# EAGLE schematic MultiWiiChassis_messed (EAGLE 6.2)
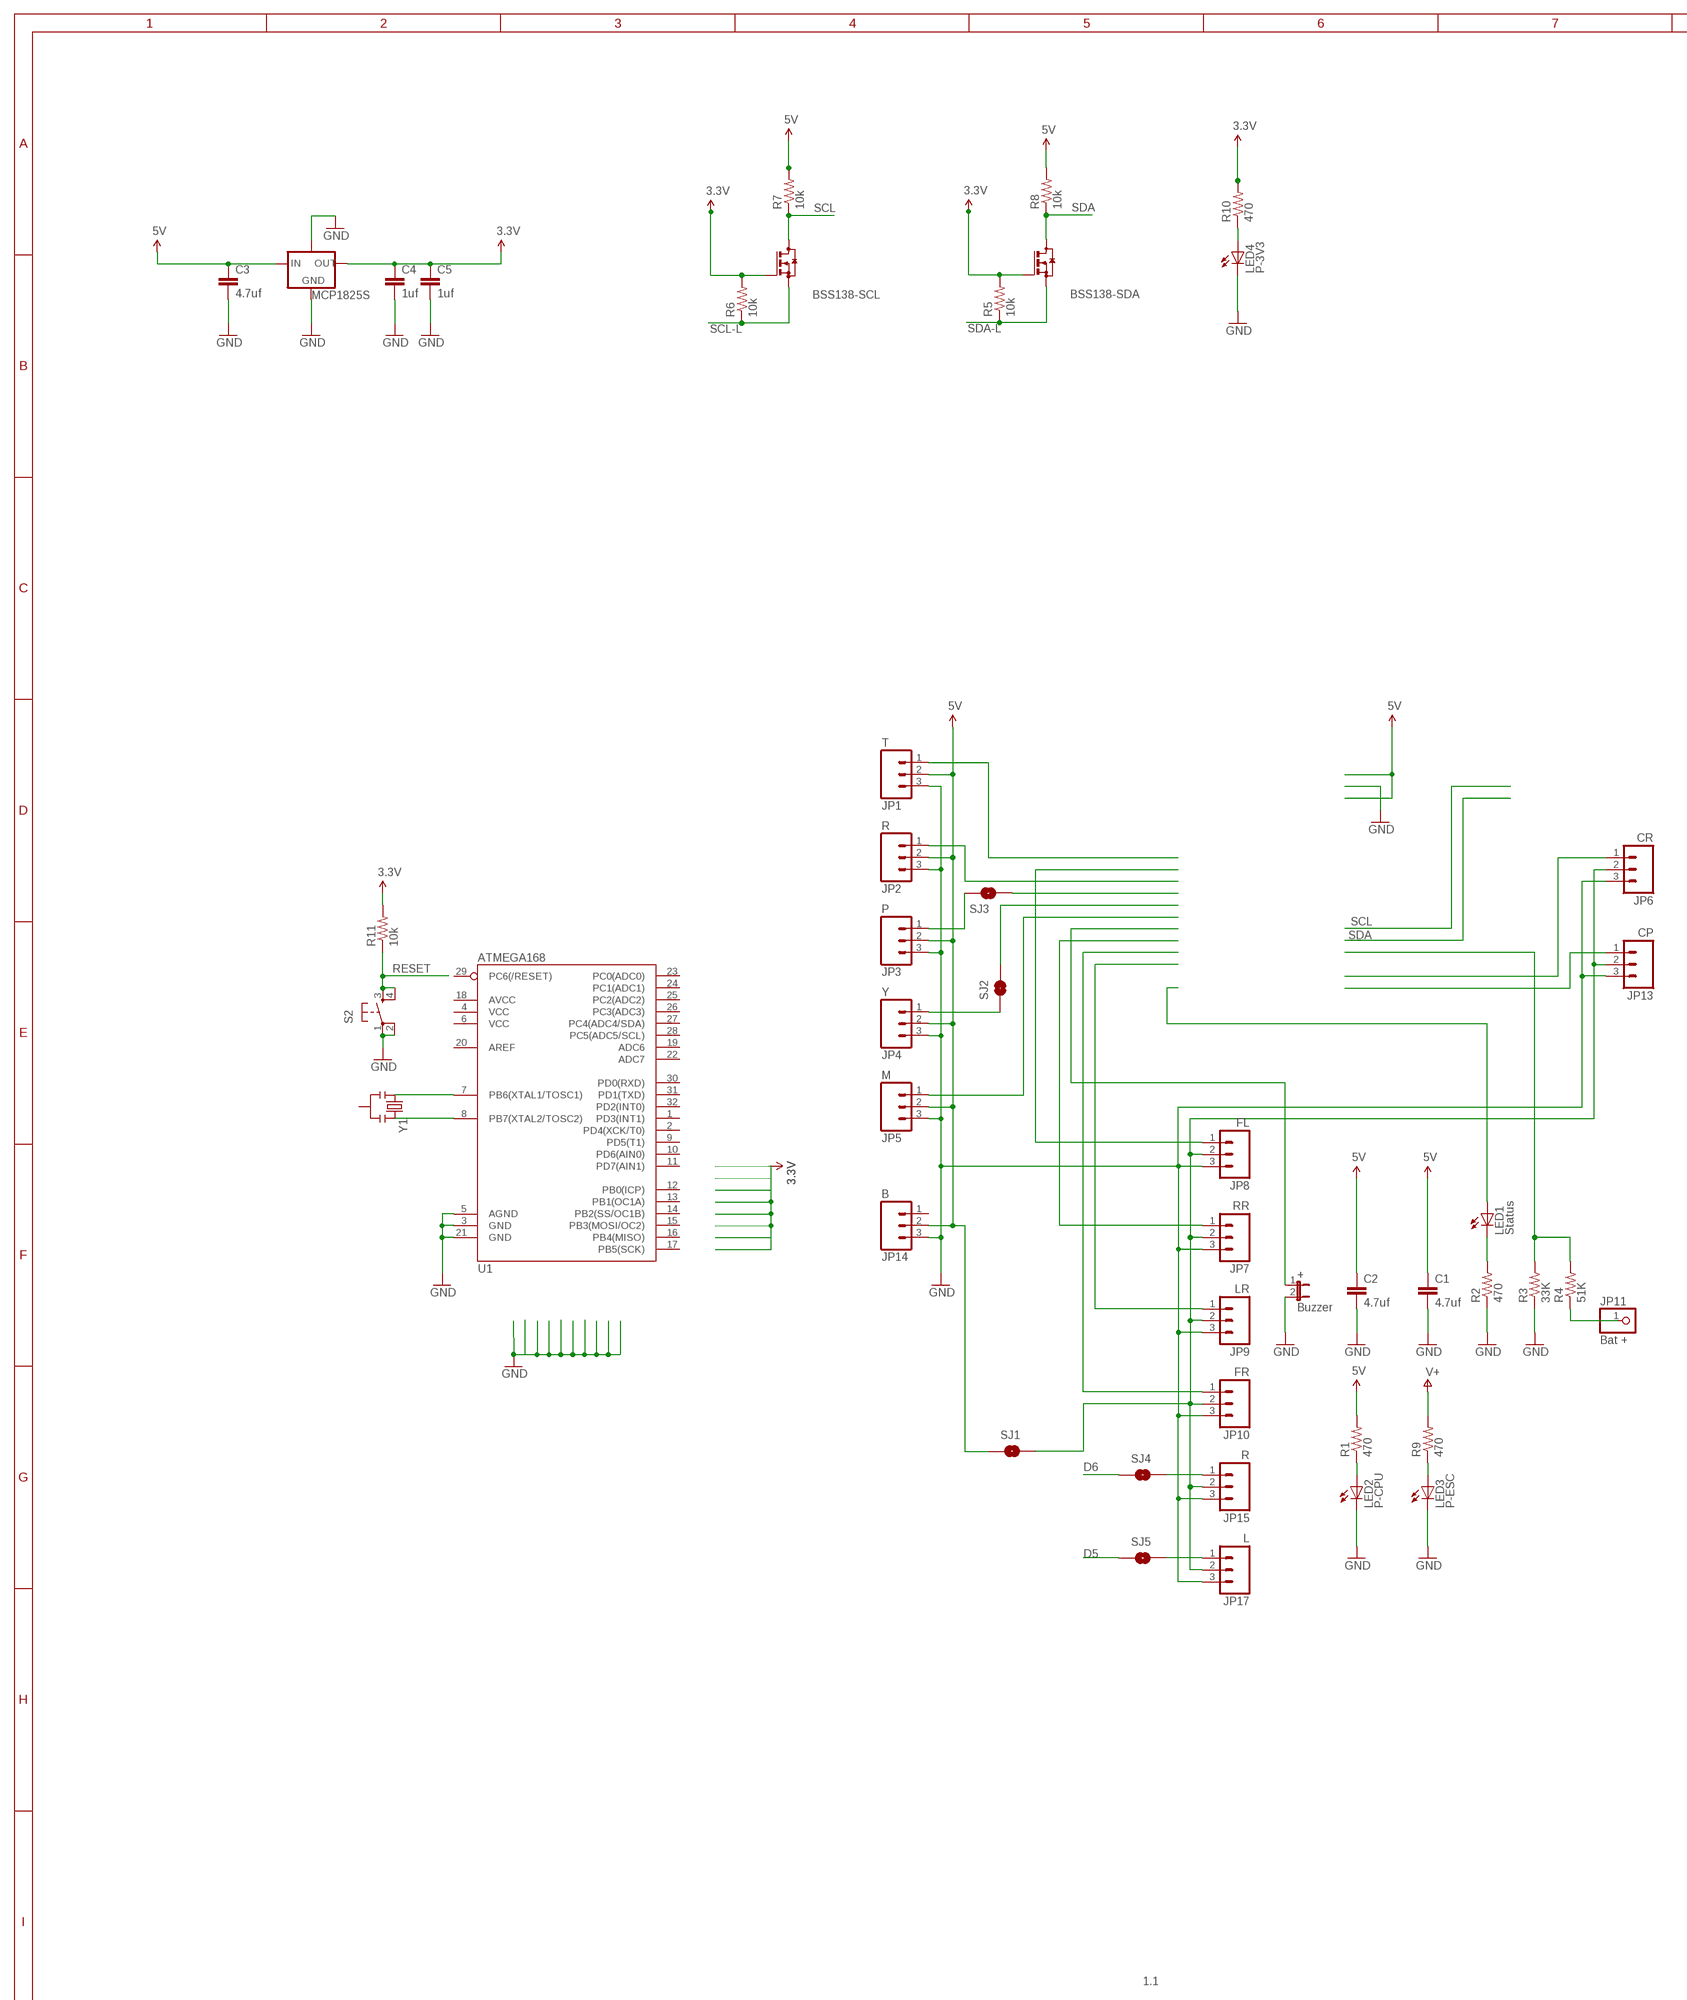
[diagram p0: schematic, sheet 1, part 1 of 2]
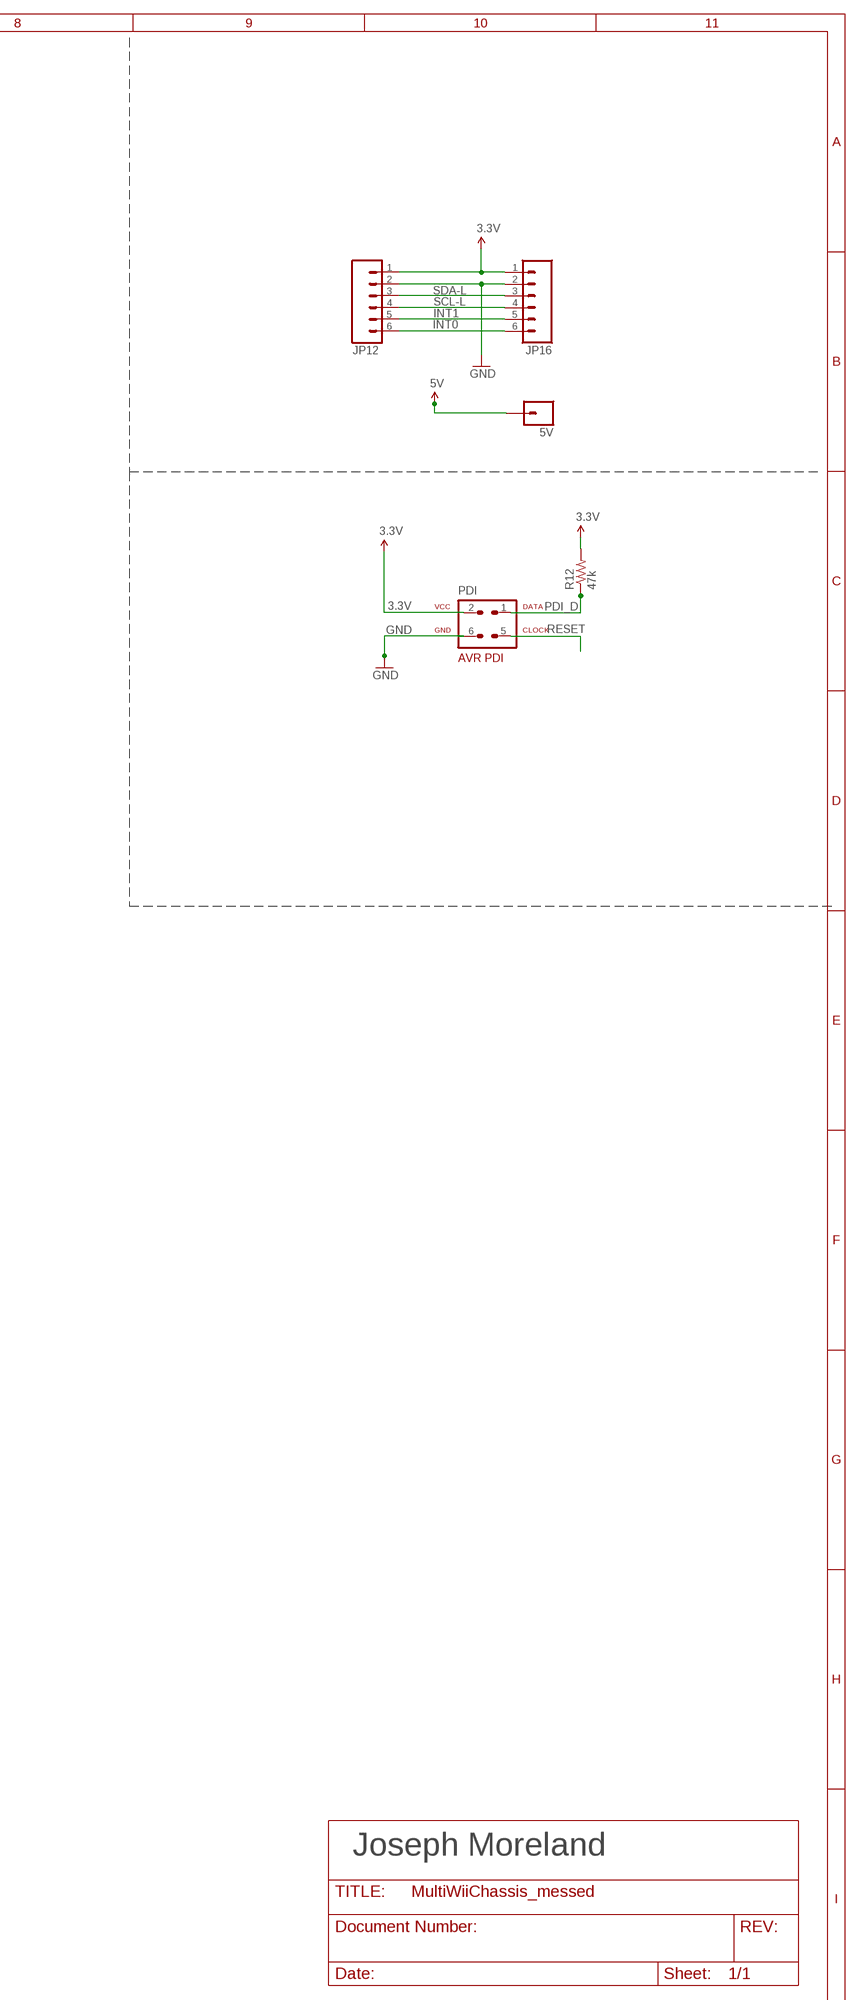
[diagram p1: schematic, sheet 1, part 2 of 2]

## Parts
5V  M01PTH  [1X01]
+  Buzzer  JUMPER-2PTH  [1X02]
BSS138-SCL  BSS138BOTTOM  [SOT23_BOT]
BSS138-SDA  BSS138BOTTOM  [SOT23_BOT]
C1  4.7uf  CAP0805  [0805]
C2  4.7uf  CAP0805  [0805]
C3  4.7uf  CAP0805  [0805]
C4  1uf  CAP0805  [0805]
C5  1uf  CAP0805  [0805]
JP1  T  M03PTH  [1X03]
JP2  R  M03PTH  [1X03]
JP3  P  M03PTH  [1X03]
JP4  Y  M03PTH  [1X03]
JP5  M  M03PTH  [1X03]
JP6  CR  M03PTH  [1X03]
JP7  RR  M03PTH  [1X03]
JP8  FL  M03PTH  [1X03]
JP9  LR  M03PTH  [1X03]
JP10  FR  M03PTH  [1X03]
JP11  Bat +  PINHD-1X1  [1X01]
JP12  M06LOCK  [1X06_LOCK]
JP13  CP  M03PTH  [1X03]
JP14  B  M03PTH  [1X03]
JP15  R  M03PTH  [1X03]
JP16  M06LOCK  [1X06_LOCK]
JP17  L  M03PTH  [1X03]
LED1  Status  LED1206  [LED-1206]
LED2  P-CPU  LED1206  [LED-1206]
LED3  P-ESC  LED1206  [LED-1206]
LED4  P-3V3  LED1206  [LED-1206]
MCP1825S  V_REG_MCP1825S  V_REG_MCP1825SBOTTOM  [SOT223_BOT]
PDI  AVR-PDIVERT  [AVR-ISP-6]
R1  470  RESISTOR0805-RES  [0805]
R2  470  RESISTOR0805-RES  [0805]
R3  33K  RESISTOR0805-RES  [0805]
R4  51K  RESISTOR0805-RES  [0805]
R5  10k  RESISTOR0805-RES  [0805]
R6  10k  RESISTOR0805-RES  [0805]
R7  10k  RESISTOR0805-RES  [0805]
R8  10k  RESISTOR0805-RES  [0805]
R9  470  RESISTOR0805-RES  [0805]
R10  470  RESISTOR0805-RES  [0805]
R11  10k  RESISTOR0603-RES  [0603-RES]
R12  47k  RESISTOR0603-RES  [0603-RES]
S2  TAC_SWITCHSMD  [TACTILE_SWITCH_SMD]
SJ1  SOLDERJUMPERNO  [SJ_2S-NO]
SJ2  SOLDERJUMPERNO  [SJ_2S-NO]
SJ3  SOLDERJUMPERNO  [SJ_2S-NO]
SJ4  SOLDERJUMPERNO  [SJ_2S-NO]
SJ5  SOLDERJUMPERNO  [SJ_2S-NO]
U1  ATMEGA168  [TQFP32-08]
Y1  RESONATORSMD  [RESONATOR-SMD]

## Nets
3.3V: BSS138-SCL.G BSS138-SDA.G C4.1 C5.1 JP12.1 JP16.1 MCP1825S.3(OUT) PDI.2 R5.2 R6.2 R10.2 R11.2 R12.2
5V: 5V.1 C1.1 C2.1 C3.1 JP1.2 JP2.2 JP3.2 JP4.2 JP5.2 JP14.2 MCP1825S.1(IN) R1.2 R7.2 R8.2 SJ1.1
BUZZER: +.1
D5: SJ3.2 SJ5.1
D6: SJ2.2 SJ4.1
GND: +.2 C1.2 C2.2 C3.2 C4.2 C5.2 JP1.3 JP2.3 JP3.3 JP4.3 JP5.3 JP6.3 JP7.3 JP8.3 JP9.3 JP10.3 JP12.2 JP13.3 JP14.3 JP15.3 JP16.2 JP17.3 LED2.C LED3.C LED4.C MCP1825S.2(GND) MCP1825S.GNDPAD PDI.6 R2.1 R3.1 S2.1 S2.2 U1.3(GND) U1.5(AGND) U1.21(GND)
INT0: JP12.6 JP16.6
INT1: JP12.5 JP16.5
N$1: LED1.C R2.2
N$2: LED2.A R1.1
N$3: JP11.1 R4.1
N$4: R3.2 R4.2
N$5: LED1.A
N$6: JP1.1
N$7: JP2.1
N$8: JP3.1 SJ3.1
N$9: JP15.1 SJ4.2
N$10: JP5.1
N$11: JP8.1
N$12: JP7.1
N$13: LED4.A R10.1
N$14: JP10.1
N$15: JP6.1
N$16: LED3.A R9.1
N$17: JP4.1 SJ2.1
N$18: JP17.1 SJ5.2
N$19: JP13.1
N$21: U1.7(PB6(XTAL1/TOSC1)) Y1.1
N$22: U1.8(PB7(XTAL2/TOSC2)) Y1.3
N$23: JP9.1
PDI_D: PDI.1 R12.1
RESET: PDI.5 R11.1 S2.3 S2.4
SCL: BSS138-SCL.D R7.1
SCL-L: BSS138-SCL.S JP12.4 JP16.4 R6.1
SDA: BSS138-SDA.D R8.1
SDA-L: BSS138-SDA.S JP12.3 JP16.3 R5.1
VESC: JP6.2 JP7.2 JP8.2 JP9.2 JP10.2 JP13.2 JP15.2 JP17.2 R9.2 SJ1.2 ; supply symbol labelled V+
Unconnected: JP14.1 U1.1(PD3(INT1)) U1.2(PD4(XCK/T0)) U1.4(VCC) U1.6(VCC) U1.9(PD5(T1)) U1.10(PD6(AIN0)) U1.11(PD7(AIN1)) U1.12(PB0(ICP)) U1.13(PB1(OC1A)) U1.14(PB2(SS/OC1B)) U1.15(PB3(MOSI/OC2)) U1.16(PB4(MISO)) U1.17(PB5(SCK)) U1.18(AVCC) U1.19(ADC6) U1.20(AREF) U1.22(ADC7) U1.23(PC0(ADC0)) U1.24(PC1(ADC1)) U1.25(PC2(ADC2)) U1.26(PC3(ADC3)) U1.27(PC4(ADC4/SDA)) U1.28(PC5(ADC5/SCL)) U1.29(PC6(/RESET)) U1.30(PD0(RXD)) U1.31(PD1(TXD)) U1.32(PD2(INT0)) Y1.2

## Notes on the sheet
- Joseph Moreland
- 1.1

## Library data of the parts
5V = SparkFun:M01: Header 1 Standard 1-pin 0.1" header. Use with straight break away headers (SKU : PRT-00116), right angle break away headers (PRT-00553), swiss pins (PRT-00743), machine pins (PRT-00117), and female headers (PRT-00115).
+ = SparkFun:JUMPER-2: Jumper Basic 0.1" spaced jumper. Use with breakaway headers.
BSS138-SCL BSS138-SDA = JCM:BSS138
C1-C5 = SparkFun:CAP: Capacitor Standard 0603 ceramic capacitor, and 0.1" leaded capacitor.
JP1-JP10 JP13-JP15 JP17 = SparkFun:M03: Header 3 Standard 3-pin 0.1" header. Use with straight break away headers (SKU : PRT-00116), right angle break away headers (PRT-00553), swiss pins (PRT-00743), machine pins (PRT-00117), and female headers (PRT-00115). Molex polarized connector foot print use with SKU : PRT-08232 with associated crimp pins and housings.
JP11 = pinhead:PINHD-1X1: PIN HEADER
JP12 JP16 = SparkFun:M06: Header 6 Standard 6-pin 0.1" header. Use with straight break away headers (SKU : PRT-00116), right angle break away headers (PRT-00553), swiss pins (PRT-00743), machine pins (PRT-00117), and female headers (PRT-00115). Molex polarized connector foot print use with SKU : PRT-08094 with associated crimp pins and housings. NOTES ON THE VARIANTS LOCK and LOCK_LONGPADS... This footprint was designed to help hold the alignment of a through-hole component (i.e. 6-pin header) while soldering it into place. You may notice that each hole has been shifted either up or down by 0.005 of an inch from it's more standard position (which is a perfectly straight line). This slight alteration caused the pins (the squares in the middle) to touch the edges of the holes. Because they are alternating, it causes a "brace" to hold the component in place. 0.005 has proven to be the perfect amount of "off-center" position when using our standard breakaway headers. Although looks a little odd when you look at the bare footprint, once you have a header in there, the alteration is very hard to notice. Also, if you push a header all the way into place, it is covered up entirely on the bottom side. This idea of altering the position of holes to aid alignment will be further integrated into the Sparkfun Library for other footprints. It can help hold any component with 3 or more connection pins.
LED1-LED4 = SparkFun:LED: LEDs Standard schematic elements and footprints for 5mm, 3mm, 1206, and 0603 sized LEDs. 5mm - Spark Fun Electronics SKU : COM-00529 (and others)
MCP1825S = JCM:V_REG_MCP1825S: MCP1825S (ww1.microchip.com/downloads/en/DeviceDoc/22056b.pdf) - 500 mA, Low Voltage, Low Quiescent Current LDO Regulator
PDI = avr-7:AVR-PDI: AVR PDI programming interface connector
R1-R12 = SparkFun:RESISTOR: Resistor Basic schematic elements and footprints for 0603, 1206, and PTH resistors.
S2 = SparkFun:TAC_SWITCH: Momentary Switch Button commonly used for reset or general input. Spark Fun Electronics SKU : COM-00097
SJ1-SJ5 = SparkFun:SOLDERJUMPER: Solder Jumper Standard SMD solder jumper. Used to automate production. Two varients : Normally Open and Normally Closed are the same, but have different paste layers. NC will have a large amount of paste and should jumper during reflow.
U1 = SparkFun-DigitalIC:ATMEGA168: Atmel 32-pin 8-bit micro, 16k flash.
Y1 = SparkFun-FreqCtrl:RESONATOR: Resonator Small SMD resonator. This is the itty bitty 10/20MHz resonators with built in caps. CSTCE10M0G55 and CSTCE20M0V53. Footprint has been reviewed closely but hasn't been tested yet.